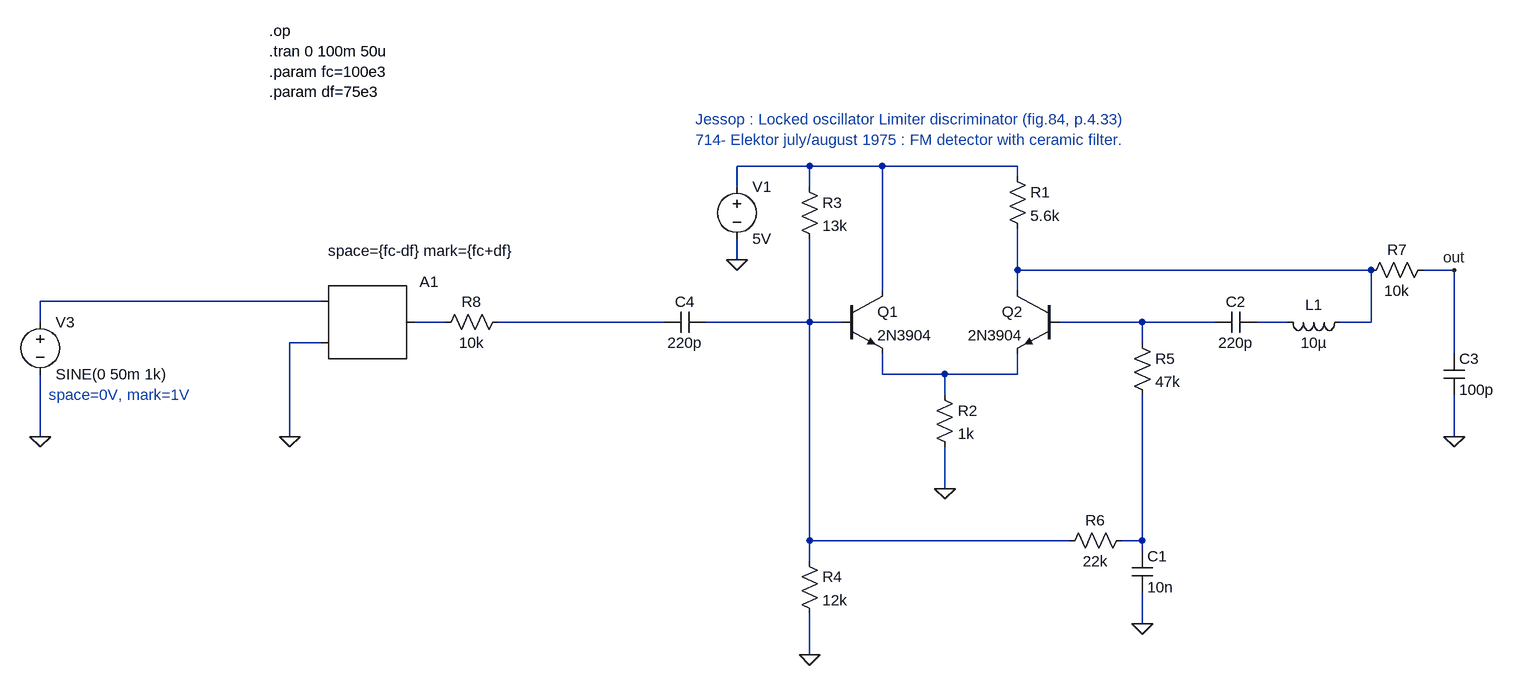
[diagram p0: schematic LOLD_5V.asc]
LOLD_5V.asc, the LTspice schematic file:
Version 4
SHEET 1 1144 756
WIRE 80 -16 -32 -16
WIRE 192 -16 80 -16
WIRE 400 -16 192 -16
WIRE 400 0 400 -16
WIRE -32 16 -32 -16
WIRE 80 16 80 -16
WIRE -32 128 -32 96
WIRE 400 144 400 80
WIRE 944 144 400 144
WIRE 1072 144 1024 144
WIRE 192 176 192 -16
WIRE 400 176 400 144
WIRE -672 192 -1104 192
WIRE -1104 224 -1104 192
WIRE -480 224 -528 224
WIRE -144 224 -400 224
WIRE 80 224 80 96
WIRE 80 224 -80 224
WIRE 128 224 80 224
WIRE 592 224 464 224
WIRE 704 224 592 224
WIRE 816 224 768 224
WIRE 944 224 944 144
WIRE 944 224 896 224
WIRE -672 256 -720 256
WIRE 592 256 592 224
WIRE 1072 272 1072 144
WIRE 192 304 192 272
WIRE 288 304 192 304
WIRE 400 304 400 272
WIRE 400 304 288 304
WIRE 288 336 288 304
WIRE -1104 400 -1104 304
WIRE -720 400 -720 256
WIRE 1072 400 1072 336
WIRE 288 480 288 416
WIRE 80 560 80 224
WIRE 480 560 80 560
WIRE 592 560 592 336
WIRE 592 560 560 560
WIRE 592 576 592 560
WIRE 80 592 80 560
WIRE 592 688 592 640
WIRE 80 736 80 672
FLAG -32 128 0
FLAG 80 736 0
FLAG 288 480 0
FLAG 592 688 0
FLAG 1072 400 0
FLAG -720 400 0
FLAG -1104 400 0
FLAG 1072 144 out
DATAFLAG -16 224 ""
DATAFLAG 288 304 ""
DATAFLAG 560 224 ""
DATAFLAG 224 560 ""
DATAFLAG 592 416 ""
DATAFLAG 512 144 ""
SYMBOL npn 128 176 R0
SYMATTR InstName Q1
SYMATTR Value 2N3904
SYMBOL npn 464 176 M0
SYMATTR InstName Q2
SYMATTR Value 2N3904
SYMBOL res 384 -16 R0
SYMATTR InstName R1
SYMATTR Value 5.6k
SYMBOL res 272 320 R0
SYMATTR InstName R2
SYMATTR Value 1k
SYMBOL res 64 0 R0
SYMATTR InstName R3
SYMATTR Value 13k
SYMBOL res 64 576 R0
SYMATTR InstName R4
SYMATTR Value 12k
SYMBOL res 576 240 R0
SYMATTR InstName R5
SYMATTR Value 47k
SYMBOL cap 576 576 R0
SYMATTR InstName C1
SYMATTR Value 10n
SYMBOL res 576 544 R90
WINDOW 0 0 56 VBottom 2
WINDOW 3 32 56 VTop 2
SYMATTR InstName R6
SYMATTR Value 22k
SYMBOL cap 768 208 R90
WINDOW 0 0 32 VBottom 2
WINDOW 3 32 32 VTop 2
SYMATTR InstName C2
SYMATTR Value 220p
SYMBOL ind 912 208 R90
WINDOW 0 5 56 VBottom 2
WINDOW 3 32 56 VTop 2
SYMATTR InstName L1
SYMATTR Value 10µ
SYMBOL res 1040 128 R90
WINDOW 0 0 56 VBottom 2
WINDOW 3 32 56 VTop 2
SYMATTR InstName R7
SYMATTR Value 10k
SYMBOL cap 1056 272 R0
SYMATTR InstName C3
SYMATTR Value 100p
SYMBOL cap -80 208 R90
WINDOW 0 0 32 VBottom 2
WINDOW 3 32 32 VTop 2
SYMATTR InstName C4
SYMATTR Value 220p
SYMBOL voltage -32 0 R0
SYMATTR InstName V1
SYMATTR Value 5V
SYMBOL SpecialFunctions\\modulate -672 192 R0
WINDOW 3 11 -78 Left 2
SYMATTR Value space={fc-df} mark={fc+df}
SYMATTR InstName A1
SYMBOL res -384 208 R90
WINDOW 0 0 56 VBottom 2
WINDOW 3 32 56 VTop 2
SYMATTR InstName R8
SYMATTR Value 10k
SYMBOL voltage -1104 208 R0
WINDOW 123 0 0 Left 0
WINDOW 39 0 0 Left 0
SYMATTR InstName V3
SYMATTR Value SINE(0 50m 1k)
TEXT -96 -88 Left 2 ;Jessop : Locked oscillator Limiter discriminator (fig.84, p.4.33)\n714- Elektor july/august 1975 : FM detector with ceramic filter.
TEXT -752 -224 Left 2 !.op\n.tran 0 100m 50u\n.param fc=100e3\n.param df=75e3
TEXT -872 336 Right 2 ;space=0V, mark=1V

The netlist it stands for:
* LOLD_5V.asc
Q1 N001 N006 N009 0 2N3904
Q2 N002 N007 N009 0 2N3904
R1 N001 N002 5.6k
R2 N009 0 1k
R3 N001 N006 13k
R4 N006 0 12k
R5 N007 N010 47k
C1 N010 0 10n
R6 N010 N006 22k
C2 N008 N007 220p
L1 N002 N008 10µ
R7 out N002 10k
C3 out 0 100p
C4 N006 N005 220p
V1 N001 0 5V
A1 N003 0 0 0 0 0 N004 0 MODULATOR space={fc-df} mark={fc+df}
R8 N005 N004 10k
V3 N003 0 SINE(0 50m 1k)
.model NPN NPN
.model PNP PNP
.lib standard.bjt
* Jessop : Locked oscillator Limiter discriminator (fig.84, p.4.33)
* 714- Elektor july/august 1975 : FM detector with ceramic filter.
.op
.tran 0 100m 50u
.param fc=100e3
.param df=75e3
* space=0V, mark=1V
.backanno
.end